# Altium schematic sheet Top_Level.SchDoc
size Letter
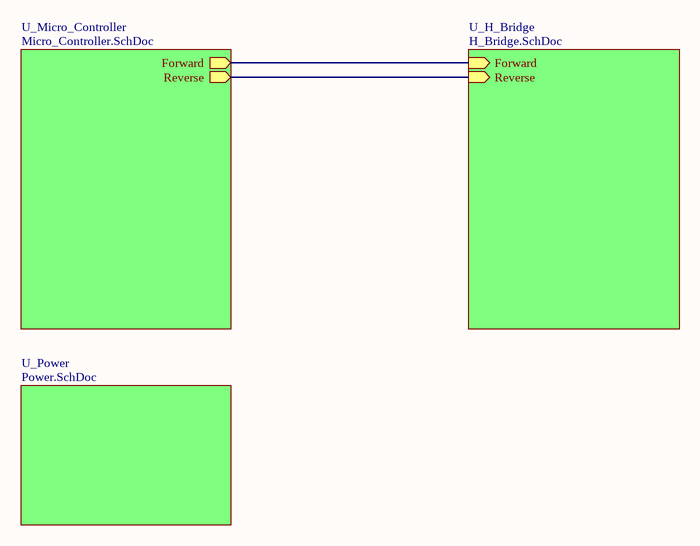
[diagram p0: Top_Level.SchDoc]

## Sub-sheets
U_H_Bridge = H_Bridge.SchDoc: Forward (in), Reverse (in)
U_Micro_Controller = Micro_Controller.SchDoc: Forward (out), Reverse (out)
U_Power = Power.SchDoc: no entries

## Nets
(unnamed): sheet U_Micro_Controller/Forward, sheet U_H_Bridge/Forward
(unnamed): sheet U_Micro_Controller/Reverse, sheet U_H_Bridge/Reverse